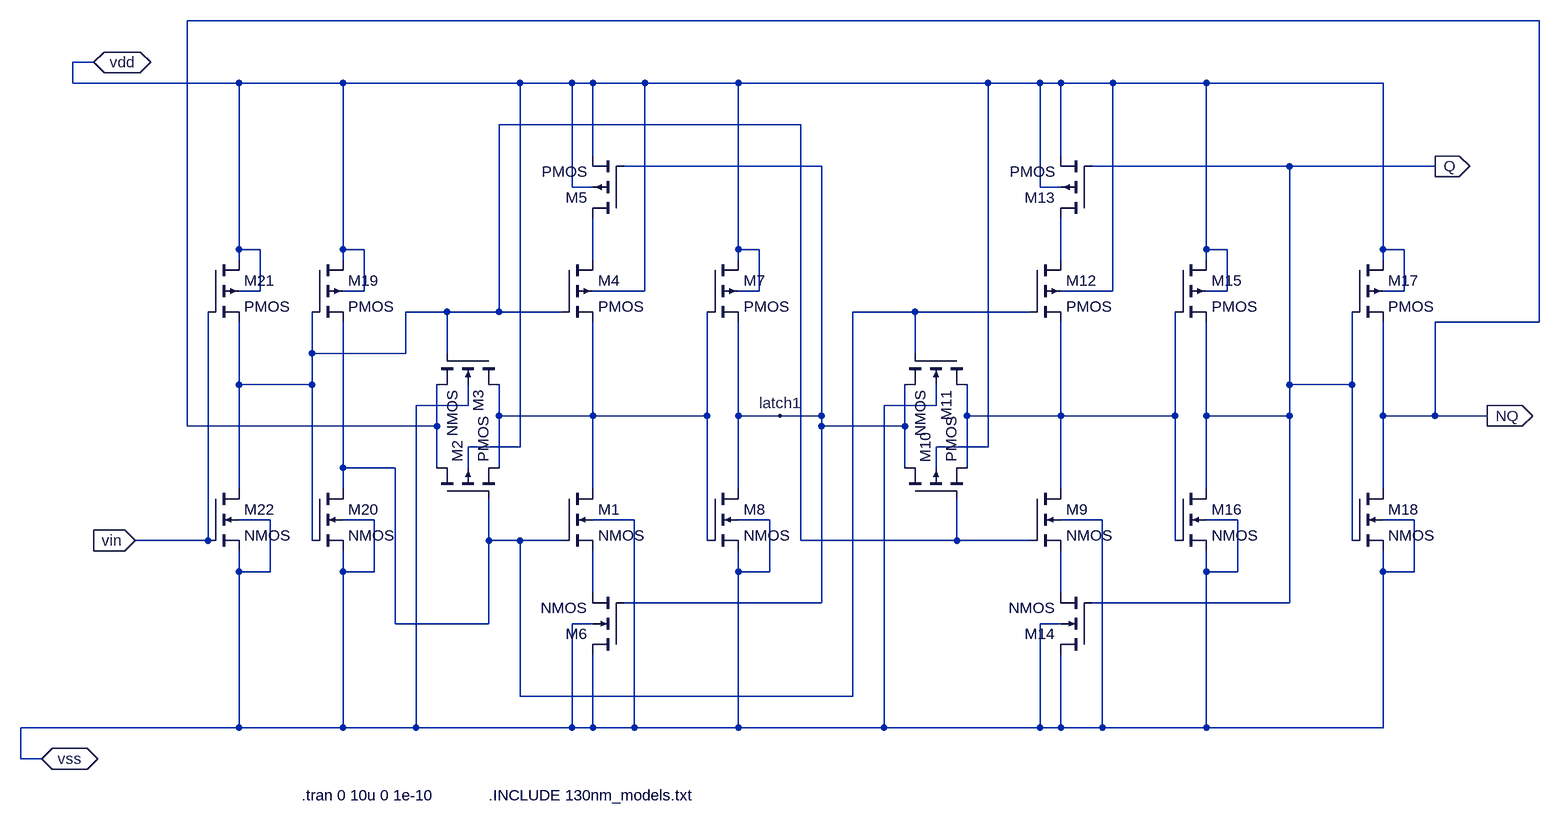
[diagram p0: schematic lowpowerdflipflop2sym.asc]
lowpowerdflipflop2sym.asc, the LTspice schematic file:
Version 4
SHEET 1 1684 680
WIRE 1552 -624 -528 -624
WIRE -672 -560 -704 -560
WIRE -704 -528 -704 -560
WIRE -448 -528 -704 -528
WIRE -288 -528 -448 -528
WIRE -16 -528 -288 -528
WIRE 64 -528 -16 -528
WIRE 96 -528 64 -528
WIRE 176 -528 96 -528
WIRE 320 -528 176 -528
WIRE 704 -528 320 -528
WIRE 784 -528 704 -528
WIRE 816 -528 784 -528
WIRE 896 -528 816 -528
WIRE 1040 -528 896 -528
WIRE 1312 -528 1040 -528
WIRE 416 -464 -48 -464
WIRE 96 -416 96 -528
WIRE 816 -416 816 -528
WIRE 448 -400 144 -400
WIRE 1168 -400 864 -400
WIRE 1392 -400 1168 -400
WIRE 64 -368 64 -528
WIRE 96 -368 64 -368
WIRE 784 -368 784 -528
WIRE 816 -368 784 -368
WIRE -448 -272 -448 -528
WIRE -416 -272 -448 -272
WIRE -288 -272 -288 -528
WIRE -256 -272 -288 -272
WIRE 320 -272 320 -528
WIRE 352 -272 320 -272
WIRE 1040 -272 1040 -528
WIRE 1072 -272 1040 -272
WIRE 1312 -272 1312 -528
WIRE 1344 -272 1312 -272
WIRE -448 -256 -448 -272
WIRE -288 -256 -288 -272
WIRE 96 -256 96 -320
WIRE 320 -256 320 -272
WIRE 816 -256 816 -320
WIRE 1040 -256 1040 -272
WIRE 1312 -256 1312 -272
WIRE -416 -208 -416 -272
WIRE -416 -208 -448 -208
WIRE -256 -208 -256 -272
WIRE -256 -208 -288 -208
WIRE 176 -208 176 -528
WIRE 176 -208 96 -208
WIRE 352 -208 352 -272
WIRE 352 -208 320 -208
WIRE 896 -208 896 -528
WIRE 896 -208 816 -208
WIRE 1072 -208 1072 -272
WIRE 1072 -208 1040 -208
WIRE 1344 -208 1344 -272
WIRE 1344 -208 1312 -208
WIRE -128 -176 -192 -176
WIRE -48 -176 -48 -464
WIRE -48 -176 -128 -176
WIRE 48 -176 -48 -176
WIRE 592 -176 496 -176
WIRE 768 -176 592 -176
WIRE 1552 -160 1552 -624
WIRE 1552 -160 1392 -160
WIRE -336 -112 -336 -176
WIRE -192 -112 -192 -176
WIRE -192 -112 -336 -112
WIRE -128 -112 -128 -176
WIRE 592 -112 592 -176
WIRE -448 -64 -448 -160
WIRE -336 -64 -336 -112
WIRE -336 -64 -448 -64
WIRE 1168 -64 1168 -400
WIRE 1264 -64 1264 -176
WIRE 1264 -64 1168 -64
WIRE -96 -32 -96 -64
WIRE -96 -32 -176 -32
WIRE 624 -32 624 -64
WIRE 624 -32 544 -32
WIRE -48 -16 -48 -64
WIRE 96 -16 96 -160
WIRE 96 -16 -48 -16
WIRE 272 -16 272 -176
WIRE 272 -16 96 -16
WIRE 320 -16 320 -160
WIRE 384 -16 320 -16
WIRE 448 -16 448 -400
WIRE 448 -16 384 -16
WIRE 672 -16 672 -64
WIRE 816 -16 816 -160
WIRE 816 -16 672 -16
WIRE 992 -16 992 -176
WIRE 992 -16 816 -16
WIRE 1040 -16 1040 -160
WIRE 1168 -16 1168 -64
WIRE 1168 -16 1040 -16
WIRE 1312 -16 1312 -160
WIRE 1392 -16 1392 -160
WIRE 1392 -16 1312 -16
WIRE 1472 -16 1392 -16
WIRE -528 0 -528 -624
WIRE -144 0 -144 -64
WIRE -144 0 -528 0
WIRE 448 0 448 -16
WIRE 576 0 576 -64
WIRE 576 0 448 0
WIRE -16 32 -16 -528
WIRE -16 32 -96 32
WIRE 704 32 704 -528
WIRE 704 32 624 32
WIRE -288 64 -288 -160
WIRE -208 64 -288 64
WIRE -144 64 -144 0
WIRE -96 64 -96 32
WIRE -48 64 -48 -16
WIRE 576 64 576 0
WIRE 624 64 624 32
WIRE 672 64 672 -16
WIRE -448 96 -448 -64
WIRE -288 96 -288 64
WIRE 96 96 96 -16
WIRE 320 96 320 -16
WIRE 816 96 816 -16
WIRE 1040 96 1040 -16
WIRE 1312 96 1312 -16
WIRE -400 144 -448 144
WIRE -240 144 -288 144
WIRE 160 144 96 144
WIRE 368 144 320 144
WIRE 880 144 816 144
WIRE 1088 144 1040 144
WIRE 1360 144 1312 144
WIRE -496 176 -496 -176
WIRE -496 176 -608 176
WIRE -336 176 -336 -64
WIRE -64 176 -64 112
WIRE -16 176 -64 176
WIRE 48 176 -16 176
WIRE 272 176 272 -16
WIRE 416 176 416 -464
WIRE 656 176 656 112
WIRE 656 176 416 176
WIRE 768 176 656 176
WIRE 992 176 992 -16
WIRE 1264 176 1264 -64
WIRE -448 224 -448 192
WIRE -400 224 -400 144
WIRE -400 224 -448 224
WIRE -288 224 -288 192
WIRE -240 224 -240 144
WIRE -240 224 -288 224
WIRE 320 224 320 192
WIRE 368 224 368 144
WIRE 368 224 320 224
WIRE 1040 224 1040 192
WIRE 1088 224 1088 144
WIRE 1088 224 1040 224
WIRE 1312 224 1312 192
WIRE 1360 224 1360 144
WIRE 1360 224 1312 224
WIRE 96 256 96 192
WIRE 816 256 816 192
WIRE 448 272 448 0
WIRE 448 272 144 272
WIRE 1168 272 1168 -16
WIRE 1168 272 864 272
WIRE -208 304 -208 64
WIRE -64 304 -64 176
WIRE -64 304 -208 304
WIRE 96 304 64 304
WIRE 816 304 784 304
WIRE -16 416 -16 176
WIRE 496 416 496 -176
WIRE 496 416 -16 416
WIRE -448 464 -448 224
WIRE -448 464 -784 464
WIRE -288 464 -288 224
WIRE -288 464 -448 464
WIRE -176 464 -176 -32
WIRE -176 464 -288 464
WIRE 64 464 64 304
WIRE 64 464 -176 464
WIRE 96 464 96 352
WIRE 96 464 64 464
WIRE 160 464 160 144
WIRE 160 464 96 464
WIRE 320 464 320 224
WIRE 320 464 160 464
WIRE 544 464 544 -32
WIRE 544 464 320 464
WIRE 784 464 784 304
WIRE 784 464 544 464
WIRE 816 464 816 352
WIRE 816 464 784 464
WIRE 880 464 880 144
WIRE 880 464 816 464
WIRE 1040 464 1040 224
WIRE 1040 464 880 464
WIRE 1312 464 1312 224
WIRE 1312 464 1040 464
WIRE -784 512 -784 464
WIRE -752 512 -784 512
FLAG 384 -16 latch1
FLAG 1472 -16 NQ
IOPIN 1472 -16 Out
FLAG 1392 -400 Q
IOPIN 1392 -400 Out
FLAG -608 176 vin
IOPIN -608 176 In
FLAG -672 -560 vdd
IOPIN -672 -560 BiDir
FLAG -752 512 vss
IOPIN -752 512 BiDir
SYMBOL nmos4 48 96 R0
SYMATTR InstName M1
SYMATTR Value2 l=.2u w=1u
SYMBOL pmos4 -144 112 R270
SYMATTR InstName M2
SYMATTR Value2 l=.2u w=10u
SYMBOL nmos4 -48 -112 R90
SYMATTR InstName M3
SYMATTR Value2 l=.2u w=10u
SYMBOL pmos4 48 -256 R0
SYMATTR InstName M4
SYMATTR Value2 l=.2u w=4u
SYMBOL pmos4 144 -320 R180
SYMATTR InstName M5
SYMATTR Value2 l=.2u w=4u
SYMBOL nmos4 144 352 R180
SYMATTR InstName M6
SYMATTR Value2 l=.2u w=1u
SYMBOL pmos4 272 -256 R0
SYMATTR InstName M7
SYMATTR Value2 l=.2u w=2u
SYMBOL nmos4 272 96 R0
SYMATTR InstName M8
SYMATTR Value2 l=.2u w=1u
SYMBOL nmos4 768 96 R0
SYMATTR InstName M9
SYMATTR Value2 l=.2u w=1u
SYMBOL pmos4 576 112 R270
SYMATTR InstName M10
SYMATTR Value2 l=.2u w=10u
SYMBOL nmos4 672 -112 R90
SYMATTR InstName M11
SYMATTR Value2 l=.2u w=10u
SYMBOL pmos4 768 -256 R0
SYMATTR InstName M12
SYMATTR Value2 l=.2u w=4u
SYMBOL pmos4 864 -320 R180
SYMATTR InstName M13
SYMATTR Value2 l=.2u w=4u
SYMBOL nmos4 864 352 R180
SYMATTR InstName M14
SYMATTR Value2 l=.2u w=1u
SYMBOL pmos4 992 -256 R0
SYMATTR InstName M15
SYMATTR Value2 l=.2u w=2u
SYMBOL nmos4 992 96 R0
SYMATTR InstName M16
SYMATTR Value2 l=.2u w=1u
SYMBOL pmos4 1264 -256 R0
SYMATTR InstName M17
SYMATTR Value2 l=.2u w=2u
SYMBOL nmos4 1264 96 R0
SYMATTR InstName M18
SYMATTR Value2 l=.2u w=1u
SYMBOL pmos4 -336 -256 R0
SYMATTR InstName M19
SYMATTR Value2 l=.2u w=2u
SYMBOL nmos4 -336 96 R0
SYMATTR InstName M20
SYMATTR Value2 l=.2u w=1u
SYMBOL pmos4 -496 -256 R0
SYMATTR InstName M21
SYMATTR Value2 l=.2u w=2u
SYMBOL nmos4 -496 96 R0
SYMATTR InstName M22
SYMATTR Value2 l=.2u w=1u
TEXT -352 568 Left 2 !.tran 0 10u 0 1e-10
TEXT -64 568 Left 2 !.INCLUDE 130nm_models.txt

The netlist it stands for:
* lowpowerdflipflop2sym.asc
M1 N005 N004 N007 vss NMOS l=.2u w=1u
M2 NQ N004 N005 vdd PMOS l=.2u w=10u
M3 N005 N001 NQ vss NMOS l=.2u w=10u
M4 N002 N001 N005 vdd PMOS l=.2u w=4u
M5 N002 latch1 vdd vdd PMOS l=.2u w=4u
M6 vss latch1 N007 vss NMOS l=.2u w=1u
M7 vdd N005 latch1 vdd PMOS l=.2u w=2u
M8 latch1 N005 vss vss NMOS l=.2u w=1u
M9 N006 N001 N008 vss NMOS l=.2u w=1u
M10 latch1 N001 N006 vdd PMOS l=.2u w=10u
M11 N006 N004 latch1 vss NMOS l=.2u w=10u
M12 N003 N004 N006 vdd PMOS l=.2u w=4u
M13 N003 Q vdd vdd PMOS l=.2u w=4u
M14 vss Q N008 vss NMOS l=.2u w=1u
M15 vdd N006 Q vdd PMOS l=.2u w=2u
M16 Q N006 vss vss NMOS l=.2u w=1u
M17 vdd Q NQ vdd PMOS l=.2u w=2u
M18 NQ Q vss vss NMOS l=.2u w=1u
M19 vdd N001 N004 vdd PMOS l=.2u w=2u
M20 N004 N001 vss vss NMOS l=.2u w=1u
M21 vdd vin N001 vdd PMOS l=.2u w=2u
M22 N001 vin vss vss NMOS l=.2u w=1u
.model NMOS NMOS
.model PMOS PMOS
.lib standard.mos
.tran 0 10u 0 1e-10
.INCLUDE 130nm_models.txt
.backanno
.end